# Altium schematic sheet pamiec_zewnetrzna.SchDoc: Flash memory
size A4
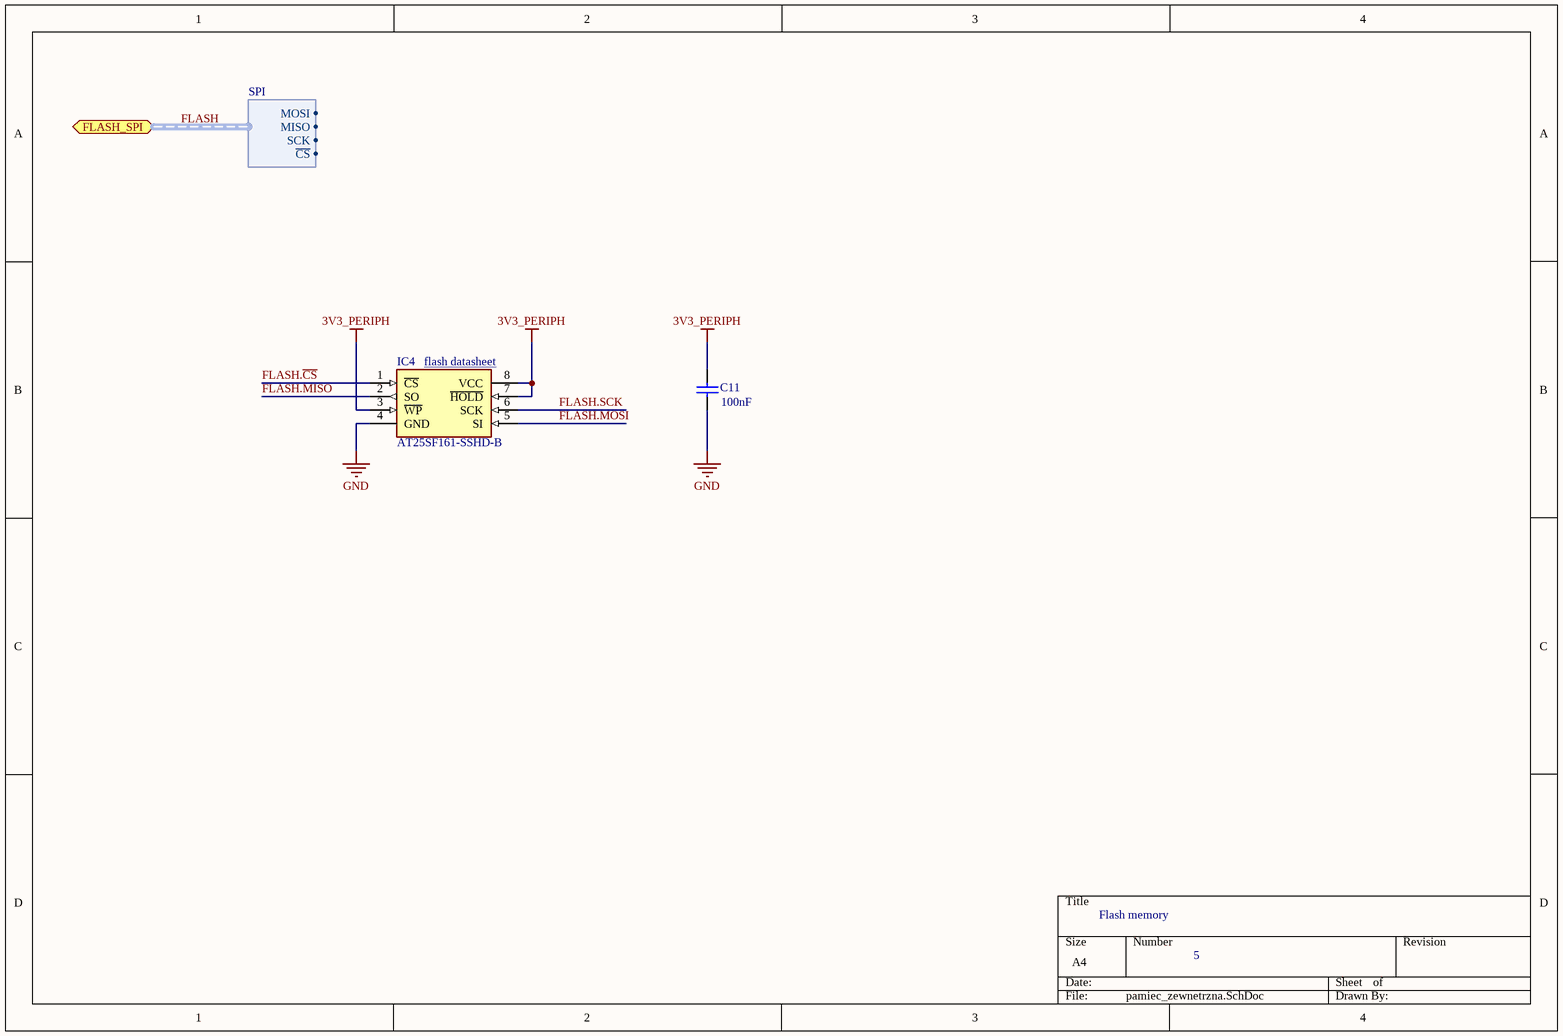
[diagram p0: pamiec_zewnetrzna.SchDoc]

## Parts
C11  value 100nF  [C0805]  (hidden comment: Cap)
IC4  AT25SF161-SSHD-B  [SOIC127P600X175-8N]

## Ports
FLASH_SPI (harness SPI)

## Harnesses
SPI: MOSI, MISO, SCK, ~{CS}

## Nets
3V3_PERIPH: C11.2 IC4.3(~{WP}) IC4.7(~{HOLD}) IC4.8(VCC)
GND: C11.1 IC4.4(GND)
FLASH.~{CS}: IC4.1(~{CS})
FLASH.MISO: IC4.2(SO)
FLASH.MOSI: IC4.5(SI)
FLASH.SCK: IC4.6(SCK)

## Buses and harness runs
harness FLASH = port FLASH_SPI

## Notes on the sheet
- (near IC4) flash datasheet <https://www.adestotech.com/wp-content/uploads/DS-AT25SF081_045.pdf>
- 5

## Library data of the parts
C11 = Cap: Capacitor; Published: 8-Jun-2000; LatestRevisionDate: 17-Jul-2002; LatestRevisionNote: Re-released for DXP Platform.; PackageReference: RAD-0.3; Publisher: Altium Limited; PackageDescription: Radial Cap, Thru-Hole; 2 Leads; 0.3 in Pin Spacing
IC4 = AT25SF081-SSHD-B: flash memory SPI; Manufacturer_Name: Adesto Technologies; Datasheet Link: https://www.mouser.com/datasheet/2/590/DS-AT25SF081_045-1385733.pdf; Height: 1.75mm; Manufacturer_Part_Number: AT25SF081-SSHD-B; Arrow Part Number: AT25SF081-SSHD-B; Arrow Price/Stock: https://www.arrow.com/en/products/at25sf081-sshd-b/adesto-technologies-corporation-inc; Mouser Part Number: 988-AT25SF081-SSHD-B; Mouser Price/Stock: https://www.mouser.com/Search/Refine.aspx?Keyword=988-AT25SF081-SSHD-B